# EasyEDA Pro project Crazybot.eprj

# Schematic Schematic1
Create Date: 2023-04-09; Page Name: P1; Project Name: Crazybot; Schematic Name: Schematic1; Update Date: 2023-04-14; Company: 嘉立创EDA; Page Size: A4; Version: V1.0
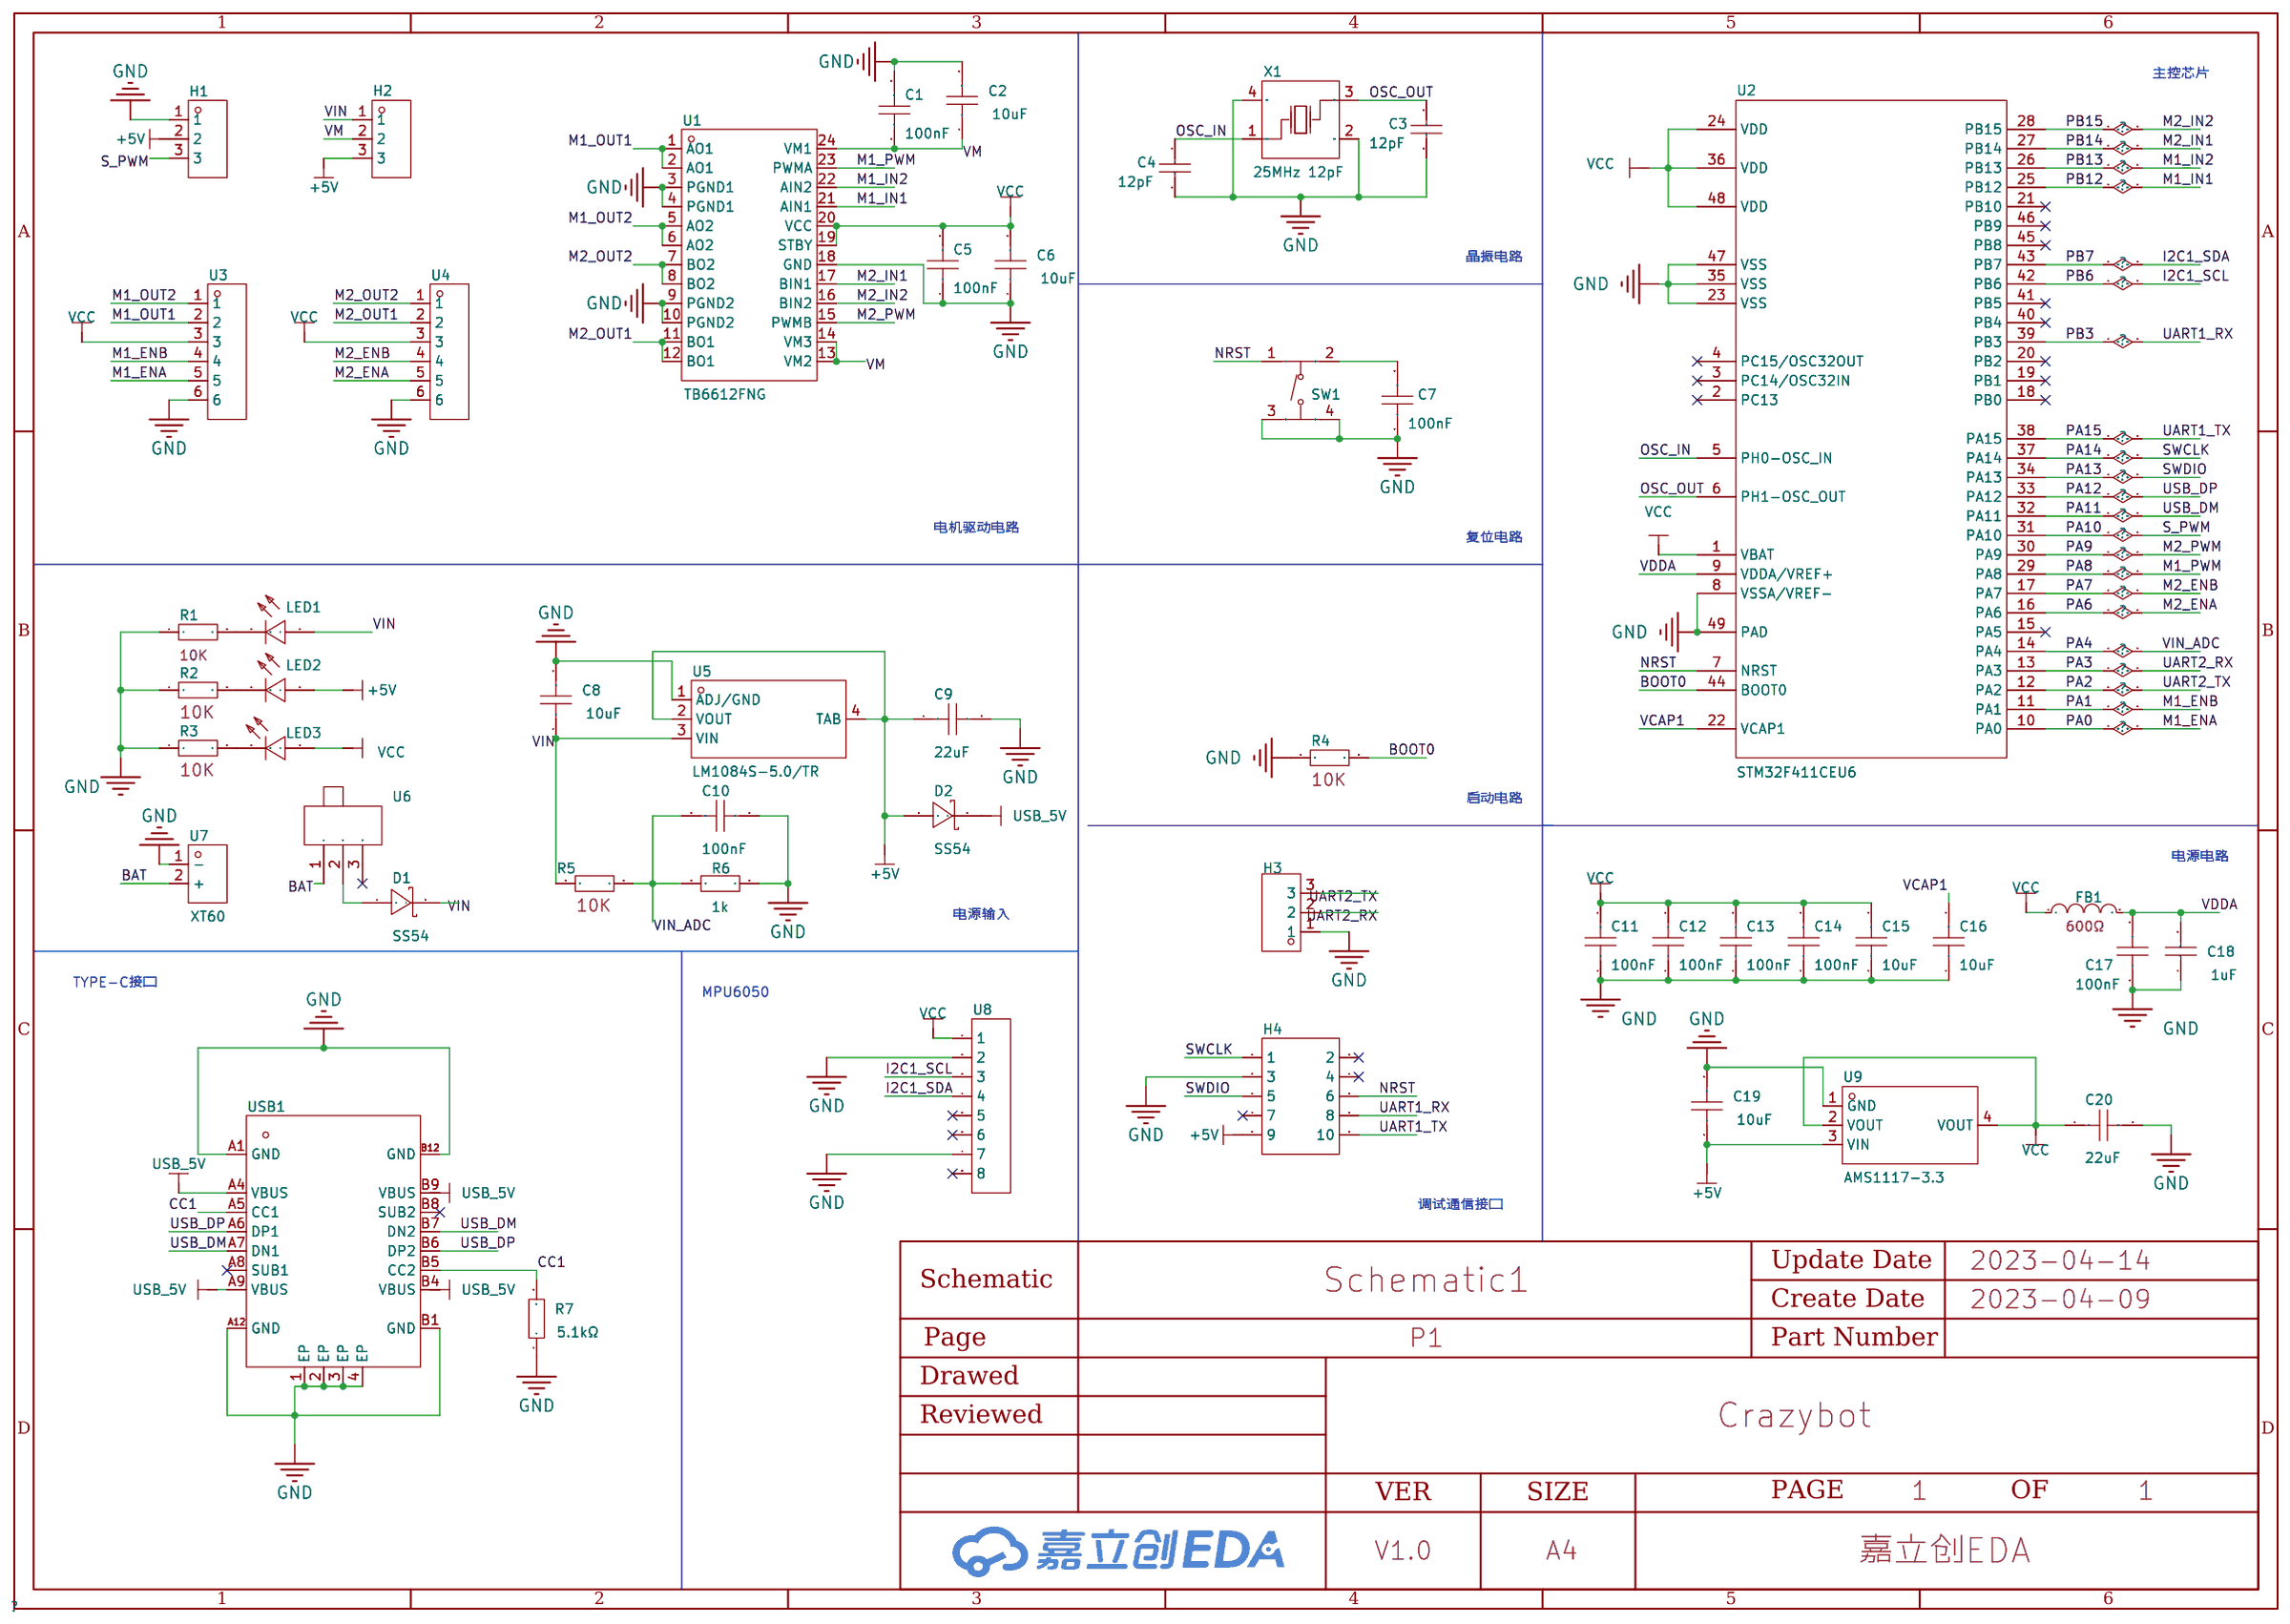
[diagram p0: schematic sheet]

## Parts
C1  100nF  [C0603]
C2  10uF  [C0603]
C3  12pF  [C0603]
C4  12pF  [C0603]
C5  100nF  [C0603]
C6  10uF  [C0603]
C7  100nF  [C0603]
C8  10uF  [C0603]
C9  22uF  [C0603]
C10  100nF  [C0603]
C11  100nF  [C0603]
C12  100nF  [C0603]
C13  100nF  [C0603]
C14  100nF  [C0603]
C15  10uF  [C0603]
C16  10uF  [C0603]
C17  100nF  [C0603]
C18  1uF  [C0603]
C19  10uF  [C0603]
C20  22uF  [C0603]
D1  SS54  [SMA_L4.4-W2.8-LS5.4-R-RD]
D2  SS54  [SMA_L4.4-W2.8-LS5.4-R-RD]
FB1  GZ1608D601TF  [L0603]
H1  -  [HDR-TH_3P-P2.54-V-M]
H2  -  [HDR-TH_3P-P2.54-V-M]
H3  -  [HDR-TH_3P-P2.54-V-F]
H4  -  [HDR-TH_10P-P2.54-V-F-R2-C5-S2.54]
LED1  19-213/Y2C-CQ2R2L/3T(CY)  [LED0603-RD-YELLOW]
LED2  19-217/GHC-YR1S2/3T  [LED0603-RD]
LED3  19-217/BHC-ZL1M2RY/3T  [LED0603-FD_BLUE]
R1  0603WAF1002T5E  [R0603]
R2  0603WAF1002T5E  [R0603]
R3  0603WAF1002T5E  [R0603]
R4  0603WAF1002T5E  [R0603]
R5  0603WAF1002T5E  [R0603]
R6  1k  [R0603]
R7  5.1kΩ  [R0603]
SW1  TS-1187A-B-A-B  [SW-SMD_4P-L5.1-W5.1-P3.70-LS6.5-TL-2]
U1  TB6612FNG  [SSOP-24_L8.4-W5.8-P0.65-LS7.8-BL]
U2  STM32F411CEU6  [UFQFPN-48_L7.0-W7.0-P0.50-BL-EP]
U3  HDGC2001WR-6P  [CONN-TH_6P-P2.00_HDGC_HDGC2001WR-6P]
U4  HDGC2001WR-6P  [CONN-TH_6P-P2.00_HDGC_HDGC2001WR-6P]
U5  LM1084S-5.0/TR  [TO-263-3_L8.6-W10.2-P2.54-LS14.4-TL]
U6  SS-12M12G5  [SW-TH_SS-12M12G5]
U7  XT60  [CONN-TH_XT60]
U8  -  [HDR-TH_8P-P2.54-V-F-1]
U9  AMS1117-3.3  [SOT-223-3_L6.5-W3.4-P2.30-LS7.0-BR]
USB1  KH-TYPE-C-16P  [USB-C-SMD_KH-TYPE-C-16P]
X1  25MHz 12pF  [OSC-SMD_4P-L3.2-W2.5-BL]

## Library data of the parts
C1 C5 C7 C10-C14 C17 = CC0603KRX7R9BB104: 容值:100nF;精度:±10%;额定电压:50V;材质(温度系数):X7R;; LCSC Part Name: 100nF ±10% 50V; Supplier Part: C14663; Manufacturer: YAGEO(国巨); Supplier Footprint: 0603; JLCPCB Part Class: 基础库; Datasheet: https://atta.szlcsc.com/upload/public/pdf/source/20180910/C282072_33301C7F631E79921B82A8DAC6BCC5B3.pdf; Supplier: LCSC; Tolerance: ±10%; Voltage Rated: 50V; Temperature Coefficient: X7R
C2 C6 C8 C15 C16 C19 = CL10A106MA8NRNC: 容值:10uF;精度:±20%;额定电压:25V;材质(温度系数):X5R;; LCSC Part Name: 10uF ±20% 25V; Supplier Part: C96446; Manufacturer: SAMSUNG(三星); Supplier Footprint: 0603; JLCPCB Part Class: 基础库; Datasheet: https://atta.szlcsc.com/upload/public/pdf/source/20170325/1490427913016.pdf; Supplier: LCSC; Tolerance: ±20%; Voltage Rated: 25V; Temperature Coefficient: X5R
C3 C4 = CL10C120JB8NNNC: 温度系数:C0G;容值:12pF;精度:±5%;额定电压:50V;; LCSC Part Name: 12pF ±5% 50V; Supplier Part: C38523; Manufacturer: SAMSUNG(三星); Supplier Footprint: 0603; JLCPCB Part Class: 基础库; Datasheet: https://atta.szlcsc.com/upload/public/pdf/source/20160103/1457707725436.pdf; Supplier: LCSC; Temperature Coefficient: C0G; Tolerance: ±5%; Voltage Rated: 50V
C9 C20 = CL10A226MQ8NRNC: 容值:22uF;精度:±20%;额定电压:6.3V;材质(温度系数):X5R;; LCSC Part Name: 22uF ±20% 6.3V; Supplier Part: C59461; Manufacturer: SAMSUNG(三星); Supplier Footprint: 0603; JLCPCB Part Class: 基础库; Datasheet: https://atta.szlcsc.com/upload/public/pdf/source/20160103/1457707740762.pdf; Supplier: LCSC; Tolerance: ±20%; Voltage Rated: 6.3V; Temperature Coefficient: X5R
C18 = CL10A105KB8NNNC: 容值:1uF;精度:±10%;额定电压:50V;材质(温度系数):X5R;; LCSC Part Name: 1uF ±10% 50V; Supplier Part: C15849; Manufacturer: SAMSUNG(三星); Supplier Footprint: 0603; JLCPCB Part Class: 基础库; Datasheet: https://atta.szlcsc.com/upload/public/pdf/source/20160103/1457707679084.pdf; Supplier: LCSC; Tolerance: ±10%; Voltage Rated: 50V; Temperature Coefficient: X5R
D1 D2 = SS54_C22452: 直流反向耐压(Vr):40V;平均整流电流(Io):5A;正向压降(Vf):550mV@5A;; LCSC Part Name: 40V 5A 550mV@5A; Supplier Part: C22452; Manufacturer: MDD; Supplier Footprint: SMA(DO-214AC); JLCPCB Part Class: 基础库; Datasheet: https://atta.szlcsc.com/upload/public/pdf/source/20230314/529CD85F9B31F69841D3A079BC07E377.pdf; Supplier: LCSC; Reverse Voltage (Vr): 40V; Average Rectified Current (Io): 5A; Forward Voltage (Vf@If): 550mV@5A
FB1 = GZ1608D601TF: 600Ω; LCSC Part Name: 600Ω@100MHz ±25%; Supplier Part: C1002; Manufacturer: Sunlord(顺络); Supplier Footprint: 0603; JLCPCB Part Class: 基础库; Datasheet: https://atta.szlcsc.com/upload/public/pdf/source/20210830/355EA7C0FAC5394FC0FE3F17C770C20A.pdf; Supplier: LCSC; Impedance @ Frequency: 600Ω@100MHz; Tolerance: ±25%; DC Resistance: 450mΩ; Current Rating: 200mA; Circuits: 1
H1 H2 = HDR-M_2.54_1x3P: Supplier Part: C2937625; Supplier Footprint: 插件
H3 = HDR-F_2.54_1x3P: Supplier Part: C541850; Supplier Footprint: 插件
H4 = HDR-F_2.54_2x5: Supplier Part: C92270; Supplier Footprint: 插件
LED1 = 19-213/Y2C-CQ2R2L/3T(CY): 发光颜色:黄灯;二极管配置:-;透镜颜色:无色透明;主波长:585.5nm~591.5nm;峰值波长:591nm;色温:-;测试电流:20mA;功率:60mW;发光角度:120°;安装方式:-;工作温度:-40℃~+85℃;; LCSC Part Name: 黄灯 585.5nm~591.5nm; Supplier Part: C72038; Manufacturer: EVERLIGHT(亿光); Supplier Footprint: 0603; JLCPCB Part Class: 基础库; Datasheet: https://atta.szlcsc.com/upload/public/pdf/source/20160507/1462613613586.pdf; Supplier: LCSC; Emitted Color: 黄灯; Lens Color: 无色透明; Dominant Wavelength: 585.5nm~591.5nm; Peak Wavelength: 591nm; Forward Current: 20mA; Power Dissipation: 60mW; Viewing Angle: 120°; Operating Temperature: -40℃~+85℃
LED2 = 19-217/GHC-YR1S2/3T: 发光颜色:翠绿;二极管配置:-;透镜颜色:无色透明;主波长:520nm~535nm;峰值波长:518nm;色温:-;测试电流:20mA;功率:110mW;发光角度:120°;安装方式:-;工作温度:-40℃~+85℃;; LCSC Part Name: 翠绿 520nm~535nm; Supplier Part: C72043; Manufacturer: EVERLIGHT(亿光); Supplier Footprint: 0603; JLCPCB Part Class: 基础库; Datasheet: https://atta.szlcsc.com/upload/public/pdf/source/20160507/1462613613780.pdf; Supplier: LCSC; Emitted Color: 翠绿; Lens Color: 无色透明; Dominant Wavelength: 520nm~535nm; Peak Wavelength: 518nm; Forward Current: 20mA; Power Dissipation: 110mW; Viewing Angle: 120°; Operating Temperature: -40℃~+85℃
LED3 = 19-217/BHC-ZL1M2RY/3T: 照明颜色:蓝色;主波长/色坐标:465~475nm;; LCSC Part Name: 0603 蓝灯; Supplier Part: C72041; Manufacturer: EVERLIGHT(亿光); Supplier Footprint: 0603; JLCPCB Part Class: 基础库; Datasheet: https://atta.szlcsc.com/upload/public/pdf/source/20170116/1484561237273.pdf; Supplier: LCSC; Mounting Type: 表面贴装; Illumination Color: 蓝色; Luminous Intensity (IF=20mA): 11.5~28.5mcd@5mA; Dominant Wavelength / Coordinate rank: 465~475nm
R1-R5 = 0603WAF1002T5E: LCSC Part Name: 10K; Supplier Part: C25804; Manufacturer: UNI-ROYAL(厚声); Supplier Footprint: 0603; JLCPCB Part Class: 基础库; Datasheet: https://atta.szlcsc.com/upload/public/pdf/source/20170920/C25804_1505901551523983377.pdf; Supplier: LCSC
R6 = 0603WAF1001T5E: 电阻类型:厚膜电阻;阻值:1kΩ;精度:±1%;功率:100mW;; LCSC Part Name: 1kΩ ±1% 100mW; Supplier Part: C21190; Manufacturer: UNI-ROYAL(厚声); Supplier Footprint: 0603; JLCPCB Part Class: 基础库; Datasheet: https://atta.szlcsc.com/upload/public/pdf/source/20200306/C422600_1E6D84923E4A46A82E41ADD87F860B5C.pdf; Supplier: LCSC; Type: 厚膜电阻; Tolerance: ±1%; Power(Watts): 100mW; Temperature Coefficient: ±100ppm/℃; Overload Voltage (Max): 75V; Operating Temperature Range: -55℃~+155℃
R7 = 0603WAF5101T5E: 电阻类型:厚膜电阻;阻值:5.1kΩ;精度:±1%;功率:100mW;; LCSC Part Name: 5.1kΩ ±1% 100mW; Supplier Part: C23186; Manufacturer: UNI-ROYAL(厚声); Supplier Footprint: 0603; JLCPCB Part Class: 基础库; Datasheet: https://atta.szlcsc.com/upload/public/pdf/source/20200306/C422600_1E6D84923E4A46A82E41ADD87F860B5C.pdf; Supplier: LCSC; Type: 厚膜电阻; Tolerance: ±1%; Power(Watts): 100mW; Temperature Coefficient: ±100ppm/℃; Overload Voltage (Max): 75V; Operating Temperature Range: -55℃~+155℃
SW1 = TS-1187A-B-A-B: 触点电流:50mA;额定电压(DC):12V;绝缘电阻:100mΩ;电路结构:单刀单掷;安装方式:立贴;按钮形状:圆形按钮;按钮/盖帽颜色:金色;带灯:无;作用力:160gf;机械寿命:100000;工作温度:-30℃~+85℃;开关长度:5.1mm;开关宽度:5.1mm;开关高度:1.5mm;带支架:无;; LCSC Part Name: 轻触开关 5.1*5.1*1.5贴片 防水金属头160gf; Supplier Part: C318884; Manufacturer: XKB Connectivity(中国星坤); Supplier Footprint: SMD; JLCPCB Part Class: 基础库; Datasheet: https://atta.szlcsc.com/upload/public/pdf/source/20200227/C318884_1F20165719E1C4CAA3E10C4C359C6E26.pdf; Supplier: LCSC; Contact Current: 50mA; Voltage Rating (DC): 12V; Insulation Resistance: 100mΩ; Circuit: 单刀单掷; Mounting Style: 立贴; Actuator Style: 圆形按钮; Actuator/Cap Color: 金色; With Lamp: 无; Operating Force: 160gf; Mechanical Life: 100000; Operating Temperature: -30℃~+85℃; Switch Length: 5.1mm; Switch Width: 5.1mm; Switch Height: 1.5mm; Strike Gundam: 无
U1 = TB6612FNG(O,C,8,EL: 双直流电机驱动器集成电路; Supplier Part: C88224; Manufacturer: TOSHIBA(东芝); Supplier Footprint: SSOP-24_208mil; JLCPCB Part Class: 扩展库; Datasheet: https://atta.szlcsc.com/upload/public/pdf/source/20170412/1491969113864.pdf; Supplier: LCSC
U2 = STM32F411CEU6: 工作电压:1.7V ~ 3.6V;主频（MAX):100MHz;; Supplier Part: C60420; Manufacturer: ST(意法半导体); Supplier Footprint: UFQFPN-48; JLCPCB Part Class: 扩展库; Datasheet: https://atta.szlcsc.com/upload/public/pdf/source/20151026/1457707507170.pdf; Supplier: LCSC; UART/USART: 3 USART; SPI: 5; USB Device: 1; PWM: 32; USB Host/OTG: 1; I2C（SMBUS/PMBUS）: 3; Voltage - Supply (Vcc/Vdd): 1.7V ~ 3.6V; A/D: 10x12bit; Program Memory Size: 512KB; RAM Size: 128KB; Speed: 100MHz; Number of I/O: 36
U3 U4 = HDGC2001WR-6P: LCSC Part Name: PH2.0弯针 6P; Supplier Part: C5175243; Manufacturer: HDGC(华德共创); Supplier Footprint: 弯插,P=2mm; JLCPCB Part Class: 扩展库; Datasheet: https://atta.szlcsc.com/upload/public/pdf/source/20220916/36534CA64A2134C65DEF28B604EC5CCB.pdf; Supplier: LCSC
U5 = LM1084S-5.0/TR: 最大输入电压:12V;压降(max):1.5V @ 5A;输出电压(可调):-;静态电流(Iq):-;输出类型:固定;输出电压(固定):5V;; Supplier Part: C259973; Manufacturer: HGSEMI(华冠); Supplier Footprint: TO-263-3L; JLCPCB Part Class: 扩展库; Datasheet: https://atta.szlcsc.com/upload/public/pdf/source/20181026/C259973_D4A8C77477BC653F2A46298C4B478943.pdf; Supplier: LCSC; Current - Supply (Max): 10mA; Voltage - Input (Max): 12V; Voltage Dropout (Max): 1.5V @ 5A; Output Current (Max): 5A; Output Configuration: 正; Ripple Rejection (PSRR): 72dB ~ 60dB(120Hz); Output Type: 固定; Number of Output Channels: 1; Operating Temperature: 0℃ ~ 125℃; Voltage - Output (Fixed): 5V
U6 = SS-12M12G5: 额定电流(DC):6A;额定电压(DC):120V;额定电流(AC):6A;额定电压(AC):120V;电路结构:单刀双掷;安装方式:弯插;机械寿命:10000;开关颜色:黑色;滑钮形状:矩形柱状;引脚样式:PC引脚;工作温度:-40℃~+85℃;开关长度:13.2mm;开关宽度:7.2mm;开关高度:6.6mm;; Supplier Part: C2884789; Manufacturer: XKB Connectivity(中国星坤); Supplier Footprint: 插件; JLCPCB Part Class: 扩展库; Datasheet: https://atta.szlcsc.com/upload/public/pdf/source/20211009/F44B934214AE410D67AA0A05A88FD376.pdf; Supplier: LCSC; Current Rating (DC): 6A; Voltage Rating (DC): 120V; Current Rating (AC): 6A; Voltage Rating (AC): 120V; Circuit: 单刀双掷; Mounting Style: 弯插; Mechanical Life: 10000; Actuator Color: 黑色; Actuator Style: 矩形柱状; Pin Style: PC引脚; Operating Temperature: -40℃~+85℃; Switch Length: 13.2mm; Switch Width: 7.2mm; Switch Height: 6.6mm
U7 = XT60: 模型锂电连接器 XT60-M; LCSC Part Name: XT60公头（电调端）; Supplier Part: C98733; Manufacturer: AMASS(艾迈斯); JLCPCB Part Class: 扩展库; Datasheet: https://atta.szlcsc.com/upload/public/pdf/source/20170606/1496716524919.pdf; Supplier: LCSC
U8 = HDR-F_2.54_1x8P: Supplier Part: C27438; Supplier Footprint: 插件
U9 = AMS1117-3.3_C6186: 输出类型:固定;输出极性:正;最大输入电压:-;输出电压:3.3V;输出电流:1A;电源纹波抑制比(PSRR):72dB@(120Hz);; LCSC Part Name: 正 Vout=3.3V 1A 72dB@(120Hz); Supplier Part: C6186; Manufacturer: AMS; Supplier Footprint: SOT-223; JLCPCB Part Class: 基础库; Datasheet: https://atta.szlcsc.com/upload/public/pdf/source/20180727/C6186_7A095716F0823C02F1997A905E26C086.pdf; Supplier: LCSC; Output Type: 固定; Output Polarity: 正; Number of Outputs: 1; Output Voltage: 3.3V; Dropout Voltage: 1.3V@(800mA); Output Current: 1A; Power Supply Rejection Ratio (PSRR): 72dB@(120Hz)
USB1 = KH-TYPE-C-16P: Type-C母座 16PIN 立式四角贴板无压片; LCSC Part Name: Type-C母座; Supplier Part: C709357; Manufacturer: kinghelm(金航标); JLCPCB Part Class: 扩展库; Datasheet: https://atta.szlcsc.com/upload/public/pdf/source/20200911/C709357_AA8DCEB38BB20E3035A7ED7AE7667837.pdf; Supplier: LCSC
X1 = X322525MOB4SI: 频率:25MHz;频率公差:±10ppm;频率稳定度:±30ppm;负载电容:12pF;; LCSC Part Name: 25MHz ±10ppm 12pF; Supplier Part: C9006; Manufacturer: YXC(扬兴晶振); Supplier Footprint: SMD3225-4P; JLCPCB Part Class: 基础库; Datasheet: https://atta.szlcsc.com/upload/public/pdf/source/20210329/C112971_1F611BDC486E193C1706F6D8EB5AA189.pdf; Supplier: LCSC; Crystal Type: 贴片无源晶振; Frequency Tolerance: ±10ppm; Frequency Stability: ±30ppm; Load Capacitance: 12pF; Operating Temperature: -40℃~+85℃

## Nets
+5V: C9.1 C19.1 D2.1(A) H1.2 H2.3 H4.9 LED2.2(A) U5.2(VOUT) U5.4(TAB) U9.3(VIN)
GND: C1.2 C2.2 C3.1 C4.1 C5.1 C6.1 C7.1 C8.2 C9.2 C10.1 C11.1 C12.1 C13.1 C14.1 C15.1 C16.1 C17.1 C18.1 C19.2 C20.2 H1.1 H3.1 H4.3 R1.1 R2.1 R3.1 R4.1 R6.2 R7.1 SW1.3(C) SW1.4(D) U1.3(PGND1) U1.4(PGND1) U1.9(PGND2) U1.10(PGND2) U1.18(GND) U2.8(VSSA/VREF-) U2.23(VSS) U2.35(VSS) U2.47(VSS) U2.49(PAD) U3.6 U4.6 U5.1(ADJ/GND) U7.1(-) U8.2 U8.7 U9.1(GND) USB1.1(EP) USB1.2(EP) USB1.3(EP) USB1.4(EP) USB1.A1(GND) USB1.A12(GND) USB1.B1(GND) USB1.B12(GND) X1.2(GND) X1.4(GND)
VCC: C5.2 C6.2 C11.2 C12.2 C13.2 C14.2 C15.2 C20.1 FB1.1 LED3.2(A) U1.19(STBY) U1.20(VCC) U2.1(VBAT) U2.24(VDD) U2.36(VDD) U2.48(VDD) U3.3 U4.3 U8.1 U9.2(VOUT) U9.4(VOUT)
VDDA: C17.2 C18.2 FB1.2 U2.9(VDDA/VREF+)
VIN: C8.1 D1.2(K) H2.1 LED1.2(A) R5.2 U5.3(VIN)
BAT: U6.1 U7.2(+)
BOOT0: R4.2 U2.44(BOOT0)
CC1: R7.2 USB1.A5(CC1) USB1.B5(CC2)
I2C1_SCL: U2.42(PB6) U8.3
I2C1_SDA: U2.43(PB7) U8.4
M1_ENA: U2.10(PA0) U3.5
M1_ENB: U2.11(PA1) U3.4
M1_IN1: U1.21(AIN1) U2.25(PB12)
M1_IN2: U1.22(AIN2) U2.26(PB13)
M1_OUT1: U1.1(AO1) U1.2(AO1) U3.2
M1_OUT2: U1.5(AO2) U1.6(AO2) U3.1
M1_PWM: U1.23(PWMA) U2.29(PA8)
M2_ENA: U2.16(PA6) U4.5
M2_ENB: U2.17(PA7) U4.4
M2_IN1: U1.17(BIN1) U2.27(PB14)
M2_IN2: U1.16(BIN2) U2.28(PB15)
M2_OUT1: U1.11(BO1) U1.12(BO1) U4.2
M2_OUT2: U1.7(BO2) U1.8(BO2) U4.1
M2_PWM: U1.15(PWMB) U2.30(PA9)
NRST: H4.6 SW1.1(A) U2.7(NRST)
OSC_IN: C4.2 U2.5(PH0-OSC_IN) X1.1(OSC1)
OSC_OUT: C3.2 U2.6(PH1-OSC_OUT) X1.3(OSC2)
PA2: H3.3 U2.12(PA2)
PA3: H3.2 U2.13(PA3)
PA4: C10.2 R5.1 R6.1 U2.14(PA4)
PA10: H1.3 U2.31(PA10)
PA11: U2.32(PA11) USB1.A7(DN1) USB1.B7(DN2)
PA12: U2.33(PA12) USB1.A6(DP1) USB1.B6(DP2)
PA13: H4.5 U2.34(PA13)
PA14: H4.1 U2.37(PA14)
PA15: H4.10 U2.38(PA15)
PB3: H4.8 U2.39(PB3)
USB_5V: D2.2(K) USB1.A4(VBUS) USB1.A9(VBUS) USB1.B4(VBUS) USB1.B9(VBUS)
VCAP1: C16.2 U2.22(VCAP1)
VM: C1.1 C2.1 H2.2 U1.13(VM2) U1.14(VM3) U1.24(VM1)
$1N8094: C7.2 SW1.2(B)
$1N67980: D1.1(A) U6.2
Net-(LED1-1): LED1.1(C) R1.2
Net-(LED2-1): LED2.1(C) R2.2
Net-(LED3-1): LED3.1(C) R3.2

Not connected (* = marked no-connect by the designer): H4 2* 4* 7*; U2 2(PC13)* 3(PC14/OSC32IN)* 4(PC15/OSC32OUT)* 15(PA5)* 18(PB0)* 19(PB1)* 20(PB2)* 21(PB10)* 40(PB4)* 41(PB5)* 45(PB8)* 46(PB9)*; U6 3*; U8 5* 6* 8*; USB1 A8(SUB1)* B8(SUB2)*

## Notes on the sheet
- 主控芯片
- 晶振电路
- 电机驱动电路
- 复位电路
- 启动电路
- 电源电路
- 电源输入
- TYPE-C接口
- MPU6050
- 调试通信接口

# Board PCB1
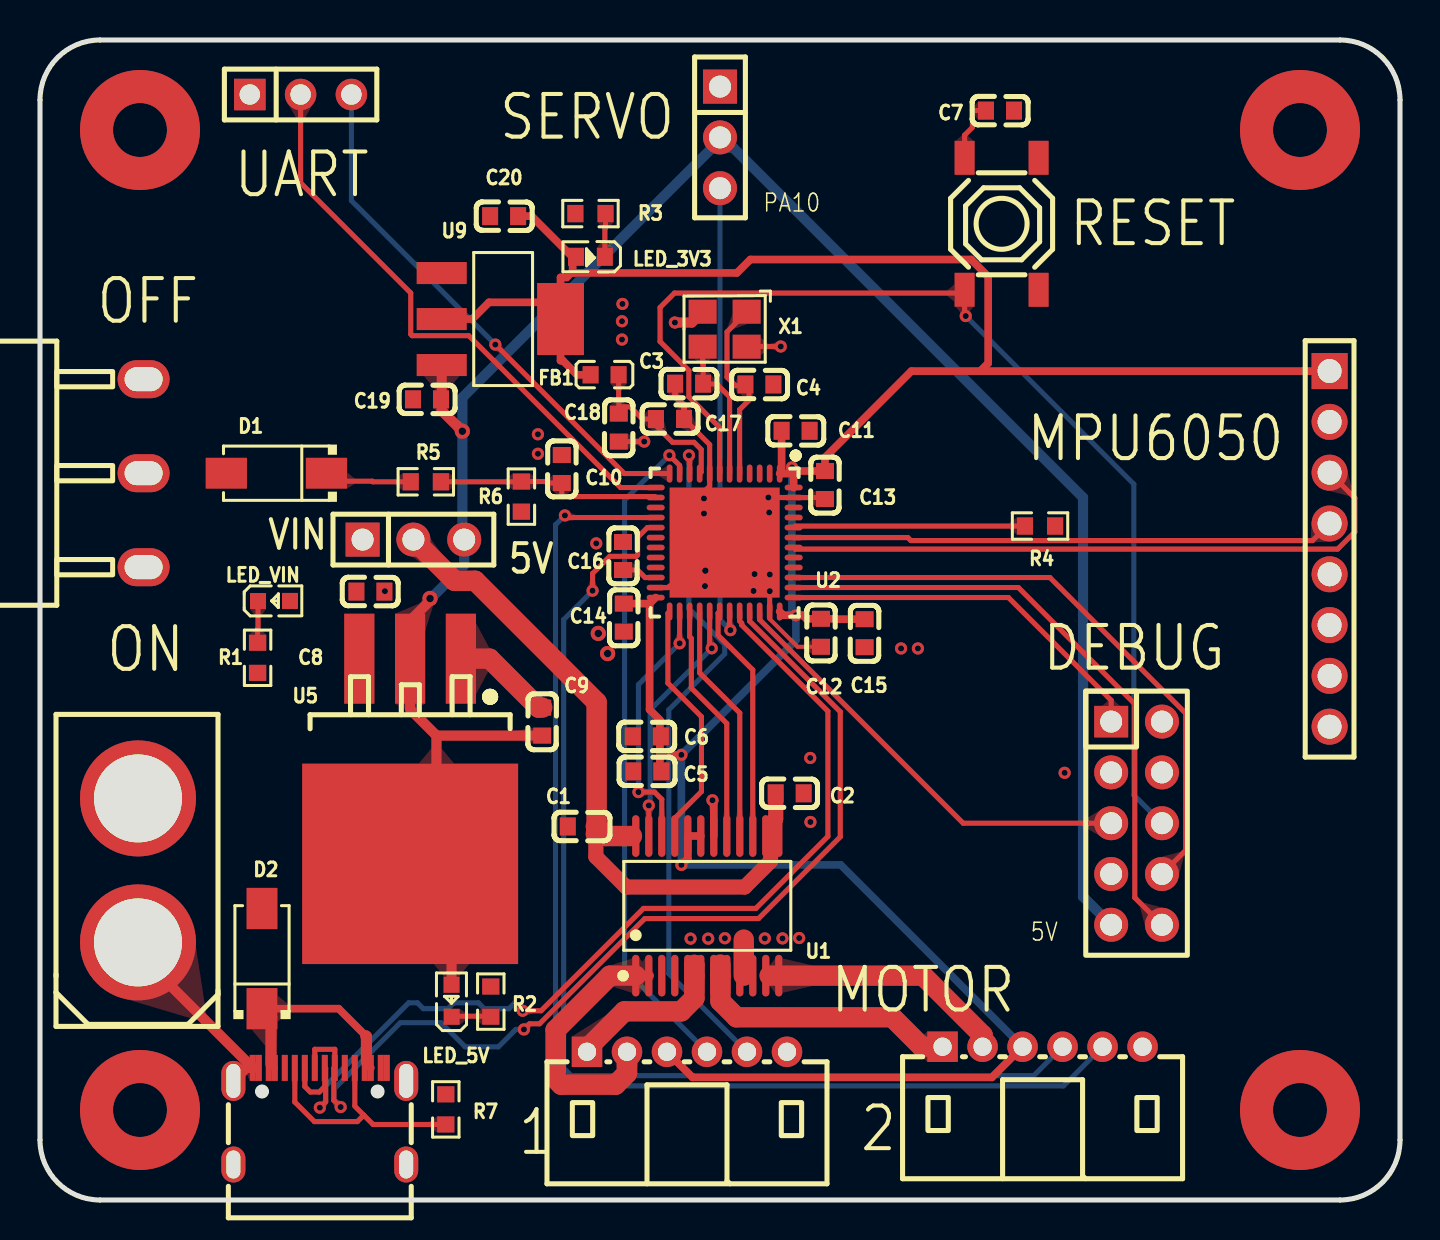
[diagram p1: board, top side]
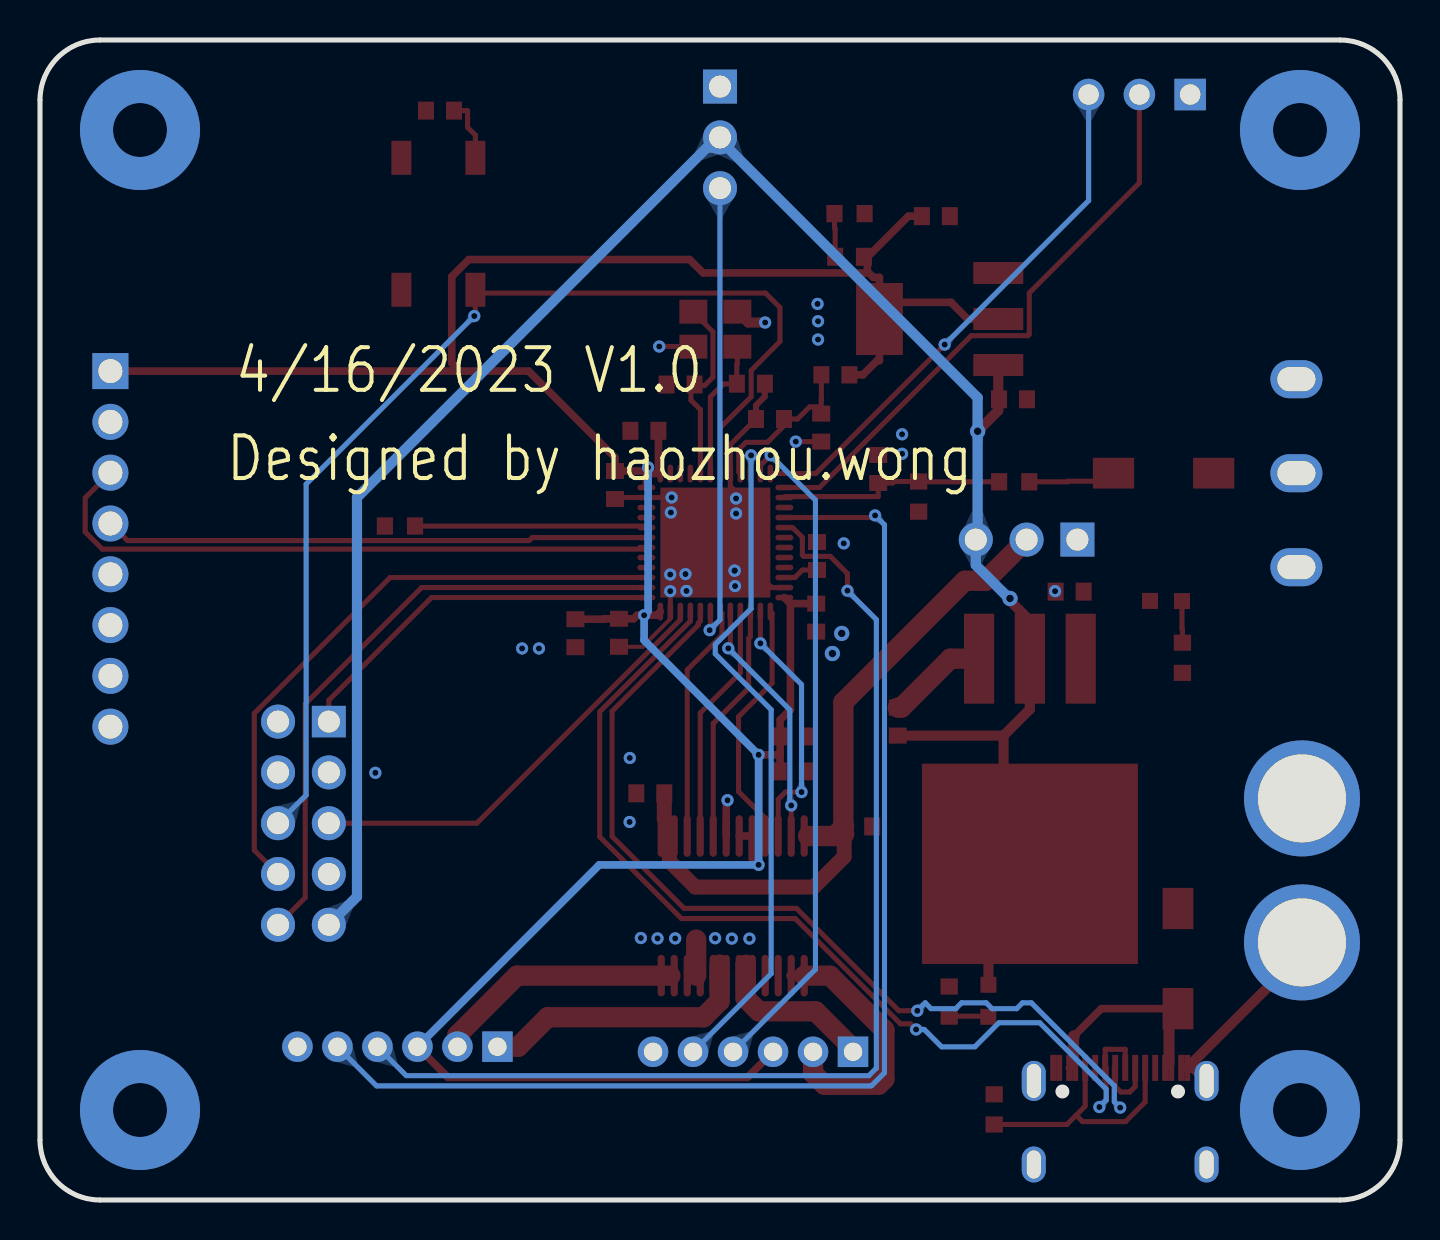
[diagram p2: board, bottom side, seen from below]

Outline 68 x 58 mm; copper layers: Top Layer, Bottom Layer. Coordinates in mm from the lower left corner of the outline.
Outline path: 0,55 0,3 arc(0.88,0.88) 3,0 65,0 arc(67.12,0.88) 68,3 68,55 arc(67.12,57.12) 65,58 3,58 arc(0.88,57.12) 0,55
Stack: Top Layer 0.035mm / Dielectric1 1.51mm FR4 er 4.5 / Bottom Layer 0.035mm

## Design rules (mm)
net PA11: DP1
net PA12: DP1
spacing safeClearance (default): track to track 0.152, other pairs 0.152 to 0.3
track width trackWidth (default): min 0.127, default 0.254, max 2.54
differential pair differentialPair (default): width min 0.127, default 0.254, max 2.54; gap min 0.152, default 0.152
via viaSize (default): diameter min 0.5, default 0.61, max 10; hole min 0.3, default 0.305, max 6

## Placement (name value [footprint] x y rotation side)
C1  100nF  [C0603]  27.09 18.68 180 top
C2  10uF  [C0603]  37.49 20.33 0 top
C3  12pF  [C0603]  32.46 40.82 0 top
C4  12pF  [C0603]  35.97 40.78 180 top
C5  100nF  [C0603]  30.36 21.43 0 top
C6  10uF  [C0603]  30.34 23.18 0 top
C7  100nF  [C0603]  48 54.47 180 top
C8  10uF  [C0603]  16.52 30.42 0 top
C9  22uF  [C0603]  25.11 23.92 90 top
C10  100nF  [C0603]  26.09 36.55 270 top
C11  100nF  [C0603]  37.78 38.46 180 top
C12  100nF  [C0603]  39.05 28.36 90 top
C13  100nF  [C0603]  39.25 35.75 90 top
C14  100nF  [C0603]  29.19 29.12 90 top
C15  10uF  [C0603]  41.23 28.34 90 top
C16  10uF  [C0603]  29.15 32.2 270 top
C17  100nF  [C0603]  31.5 39.05 180 top
C18  1uF  [C0603]  28.94 38.62 90 top
C19  10uF  [C0603]  19.35 40.03 180 top
C20  22uF  [C0603]  23.21 49.19 180 top
D1  SS54  [SMA_L4.4-W2.8-LS5.4-R-RD]  11.82 36.34 180 top
D2  SS54  [SMA_L4.4-W2.8-LS5.4-R-RD]  11.1 12.07 90 top
FB1  GZ1608D601TF  [L0603]  28.23 41.26 0 top
H1  -  [HDR-TH_3P-P2.54-V-M]  34 53.13 270 top
H2  -  [HDR-TH_3P-P2.54-V-M]  18.67 33.02 0 top
H3  -  [HDR-TH_3P-P2.54-V-F]  13.03 55.27 0 top
H4  -  [HDR-TH_10P-P2.54-V-F-R2-C5-S2.54]  54.83 18.84 270 top
LED_3V3  19-217/BHC-ZL1M2RY/3T  [LED0603-FD_BLUE]  27.52 47.16 180 top
LED_5V  19-217/GHC-YR1S2/3T  [LED0603-RD]  20.58 9.96 90 top
LED_VIN  19-213/Y2C-CQ2R2L/3T(CY)  [LED0603-RD-YELLOW]  11.7 29.95 0 top
R1  0603WAF1002T5E  [R0603]  10.88 27.11 90 top
R2  0603WAF1002T5E  [R0603]  22.54 9.92 270 top
R3  0603WAF1002T5E  [R0603]  27.52 49.32 0 top
R4  0603WAF1002T5E  [R0603]  50 33.7 180 top
R5  0603WAF1002T5E  [R0603]  19.29 35.91 180 top
R6  1k  [R0603]  24.07 35.17 270 top
R7  5.1kΩ  [R0603]  20.29 4.53 270 top
SW1  TS-1187A-B-A-B  [SW-SMD_4P-L5.1-W5.1-P3.70-LS6.5-TL-2]  48.08 48.81 90 top
U1  TB6612FNG  [SSOP-24_L8.4-W5.8-P0.65-LS7.8-BL]  33.36 14.71 0 top
U2  STM32F411CEU6  [UFQFPN-48_L7.0-W7.0-P0.50-BL-EP]  34.23 32.87 180 top
U3  HDGC2001WR-6P  [CONN-TH_6P-P2.00_HDGC_HDGC2001WR-6P]  32.35 7.41 0 top
U4  HDGC2001WR-6P  [CONN-TH_6P-P2.00_HDGC_HDGC2001WR-6P]  50.13 7.66 0 top
U5  LM1084S-5.0/TR  [TO-263-3_L8.6-W10.2-P2.54-LS14.4-TL]  18.51 21.94 270 top
U6  SS-12M12G5  [SW-TH_SS-12M12G5]  5.18 36.34 90 top
U7  XT60  [CONN-TH_XT60]  4.9 16.48 90 top
U8  -  [HDR-TH_8P-P2.54-V-F-1]  64.48 32.56 270 top
U9  AMS1117-3.3  [SOT-223-3_L6.5-W3.4-P2.30-LS7.0-BR]  23.06 44.05 180 top
USB1  KH-TYPE-C-16P  [USB-C-SMD_KH-TYPE-C-16P]  13.99 4.19 0 top
X1  25MHz 12pF  [OSC-SMD_4P-L3.2-W2.5-BL]  34.23 43.54 180 top

## Footprints (pads in the part's own frame, mm; a bottom-side part is the same pattern mirrored in y, then rotated)
C0603
  rect 0.8x0.9 smd: 1(-0.7,0) 2(0.7,0)
CONN-TH_6P-P2.00_HDGC_HDGC2001WR-6P
  rect 1.524x1.524 hole 0.914: 1(-5,0)
  round 1.524 hole 0.914: 2(-3,0) 3(-1,0) 4(1,0) 5(3,0) 6(5,0)
CONN-TH_XT60
  round 5.8 hole 4.4: 1(-3.6,0) 2(3.6,0)
HDR-TH_3P-P2.54-V-F
  rect 1.575x1.575 hole 1.02: 1(-2.54,0)
  round 1.575 hole 1.02: 2(0,0) 3(2.54,0)
HDR-TH_3P-P2.54-V-M
  rect 1.7x1.7 hole 1.1: 1(-2.54,0)
  round 1.7 hole 1.1: 2(0,0) 3(2.54,0)
HDR-TH_8P-P2.54-V-F-1
  rect 1.801x1.801 hole 1.199: 1(-8.89,0)
  round 1.801 hole 1.199: 2(-6.35,0) 3(-3.81,0) 4(-1.27,0) 5(1.27,0) 6(3.81,0) 7(6.35,0) 8(8.89,0)
HDR-TH_10P-P2.54-V-F-R2-C5-S2.54
  rect 1.575x1.7 hole 1.1: 1(-5.08,-1.27)
  round 1.7 hole 1.1: 2(-5.08,1.27) 3(-2.54,-1.27) 4(-2.54,1.27) 5(0,-1.27) 6(0,1.27) 7(2.54,-1.27) 8(2.54,1.27) 9(5.08,-1.27) 10(5.08,1.27)
L0603
  rect 0.8x0.864 smd: 1(-0.7,0) 2(0.7,0)
LED0603-FD_BLUE
  rect 0.8x0.9 smd: 1(-0.72,0) 2(0.72,0)
LED0603-RD
  rect 0.8x0.8 smd: 1(-0.799,-0.004) 2(0.799,0.004)
LED0603-RD-YELLOW
  rect 0.8x0.8 smd: 1(-0.799,-0.004) 2(0.799,0.004)
OSC-SMD_4P-L3.2-W2.5-BL
  rect 1.4x1.2 smd: 1(-1.1,-0.875) 2(1.1,-0.875) 3(1.1,0.875) 4(-1.1,0.875)
R0603
  rect 0.806x0.864 smd: 1(-0.753,0) 2(0.753,0)
SMA_L4.4-W2.8-LS5.4-R-RD
  rect 2.062x1.539 smd: 1(2.503,0) 2(-2.503,0)
SOT-223-3_L6.5-W3.4-P2.30-LS7.0-BR
  rect 2.5x1.1 smd: 1(2.97,-2.3) 2(2.97,0) 3(2.97,2.3)
  rect 2.34x3.6 smd: 4(-2.97,0)
SSOP-24_L8.4-W5.8-P0.65-LS7.8-BL
  oval 0.364x2.082 smd: 1(-3.575,-3.491) 2(-2.925,-3.491) 3(-2.275,-3.491) 4(-1.625,-3.491) 5(-0.975,-3.491) 6(-0.325,-3.491) 7(0.325,-3.491) 8(0.975,-3.491) 9(1.625,-3.491) 10(2.275,-3.491) 11(2.925,-3.491) 12(3.575,-3.491) 13(3.575,3.491) 14(2.925,3.491) 15(2.275,3.491) 16(1.625,3.491) 17(0.975,3.491) 18(0.325,3.491) 19(-0.325,3.491) 20(-0.975,3.491) 21(-1.625,3.491) 22(-2.275,3.491) 23(-2.925,3.491) 24(-3.575,3.491)
SW-SMD_4P-L5.1-W5.1-P3.70-LS6.5-TL-2
  rect 1.7x1 smd: 1(-3.3,1.85) 2(3.3,1.85) 3(-3.3,-1.85) 4(3.3,-1.85)
SW-TH_SS-12M12G5
  oval 1.9x2.6 hole 1.2x1.9: 1(-4.7,0) 2(0,0) 3(4.7,0)
TO-263-3_L8.6-W10.2-P2.54-LS14.4-TL
  rect 4.5x1.511 smd: 1(-5.128,2.54) 2(-5.128,0) 3(-5.128,-2.54)
  rect 10.02x10.8 smd: 4(5.129,0)
UFQFPN-48_L7.0-W7.0-P0.50-BL-EP
  oval 0.28x0.9 smd: 1(-2.751,-3.45) 2(-2.251,-3.45) 3(-1.75,-3.45) 4(-1.25,-3.45) 5(-0.749,-3.45) 6(-0.249,-3.45) 7(0.249,-3.45) 8(0.75,-3.45) 9(1.25,-3.45) 10(1.75,-3.45) 11(2.251,-3.45) 12(2.751,-3.45) 25(2.751,3.449) 26(2.251,3.449) 27(1.75,3.449) 28(1.25,3.449) 29(0.75,3.449) 30(0.249,3.449) 31(-0.249,3.449) 32(-0.749,3.449) 33(-1.25,3.449) 34(-1.75,3.449) 35(-2.251,3.449) 36(-2.751,3.449)
  oval 0.9x0.28 smd: 13(3.45,-2.751) 14(3.45,-2.251) 15(3.45,-1.75) 16(3.45,-1.25) 17(3.45,-0.75) 18(3.45,-0.249) 19(3.45,0.249) 20(3.45,0.749) 21(3.45,1.25) 22(3.45,1.75) 23(3.45,2.251) 24(3.45,2.751) 37(-3.449,2.751) 38(-3.449,2.251) 39(-3.449,1.75) 40(-3.449,1.25) 41(-3.449,0.749) 42(-3.449,0.249) 43(-3.449,-0.249) 44(-3.449,-0.75) 45(-3.449,-1.25) 46(-3.449,-1.75) 47(-3.449,-2.251) 48(-3.449,-2.751)
  rect 5.5x5.5 smd: 49(0,0)
USB-C-SMD_KH-TYPE-C-16P
  oval 1.2x2 hole 0.7x1.7: 1(-4.32,1.765) 2(4.32,1.765)
  oval 1.2x1.8 hole 0.7x1.4: 3(-4.32,-2.415) 4(4.32,-2.415)
  rect 0.3x1.3 smd: A1(-3.35,2.415) A4(-2.55,2.415) A5(-1.25,2.415) A6(-0.25,2.415) A7(0.25,2.415) A8(1.25,2.415) A9(2.55,2.415) A12(3.35,2.415) B1(3.05,2.415) B4(2.25,2.415) B5(1.75,2.415) B6(0.75,2.415) B7(-0.75,2.415) B8(-1.75,2.415) B9(-2.25,2.415) B12(-3.05,2.415)

## Nets
As in the schematic, except:
+5V: C9.1 C19.1 D2.1 H1.2 H2.3 H4.9 LED_5V.2 U5.2 U5.4 U9.3
VCC: C5.2 C6.2 C11.2 C12.2 C13.2 C14.2 C15.2 C20.1 FB1.1 LED_3V3.2 U1.19 U1.20 U2.1 U2.24 U2.36 U2.48 U3.3 U4.3 U8.1 U9.2 U9.4
VIN: C8.1 D1.2 H2.1 LED_VIN.2 R5.2 U5.3
$1N38986: LED_5V.1 R2.2
$1N39065: LED_3V3.1 R3.2
$1N77283: LED_VIN.1 R1.2

Pads without a net: H4 2 4 7; U2 2 3 4 15 18 19 20 21 40 41 45 46; U6 3; U8 5 6 8; USB1 A8 B8

## Via types
v1: diameter 0.61, hole 0.305, Top Layer to Bottom Layer, 53 vias
v2: diameter 6, hole 2.7, Top Layer to Bottom Layer, 4 vias
v3: diameter 0.762, hole 0.381, Top Layer to Bottom Layer, 4 vias

## Routing (per net, layer and track width the routed paths; a pad name or vN(x,y) marks a point on that pad's centre or on a via; arc(x,y) is an arc through that point)
+5V: length 108
  Top Layer w0.508: 19.82,23.22 19.82,18.32 18.31,16.81 ; 19.82,23.22 C9.1 ; 19.82,23.22 18.51,24.54 U5.2 18.51,28.97 19.5,29.97 v3(19.5,30.08) ; U5.4 20.58,14.74 LED_5V.2 ; v3(21.12,38.44) 20.09,39.47 U9.3
  Bottom Layer w0.508: v3(19.5,30.08) 19.54,30.08 21.21,31.74 H2.3 ; 34,53.13 34,52.74 ; 34,52.74 H1.2 ; 34,52.74 34.13,52.62 ; 34.17,52.66 34.13,52.62 ; 34.13,52.62 34.66,52.62 52.15,35.12 52.15,15.17 H4.9 ; 34.13,52.62 33.62,52.62 21.12,40.12 v3(21.12,38.44) 21.12,33.11 21.21,33.02
GND: length 39.6
  Top Layer w0.203: C12.1 37.88,27.66 36.48,29.05 36.48,29.42
  Top Layer w0.254: C18.1 v1(30.21,37.92) ; 35.33,42.69 35.35,42.68 v1(37.04,42.68) ; v1(33.25,30.7) 31.49,30.7 31.41,30.62 U2.23 ; C13.1 39.18,35.12 U2.47 37.05,35.12 37.05,35.13 v1(36.42,35.13) ; 36.48,29.42 36.48,30.44 v1(36.49,30.44) ; C17.1 33.48,37.77 33.48,35.69 33.2,35.41 v1(33.2,35.08)
  Top Layer w0.305: C17.1 32.2,39.73 31.76,40.17 31.76,40.8
  Top Layer w0.381: v1(33.62,19.99) 33.69,19.92 U1.18
  Top Layer w0.508: v1(31.74,43.87) 32.59,43.87 X1.2 ; U7.1 4.9,12.34 USB1.A1 10.32,6.6 9.67,5.96
  Top Layer w1.016: 35.19,11.22 35.19,13.02 ; C9.2 24.93,24.62 22.48,27.07 U5.1
  vias: v1(17.25,30.44) v1(24.9,38.29) v1(24.9,37.31) v1(27.81,32.83) v1(27.91,28.33) v1(29.12,44.8) v1(29.1,43.94) v1(29.1,43.02) v1(32.53,13.07) v1(33.2,34.32) v1(33.27,31.47) v1(33.27,31.47) v1(33.41,13.07) v1(34.24,13.09) v1(35.73,31.3) v1(35.68,30.45) v1(36.24,13.08) v1(36.46,34.37) v1(36.49,31.28) v1(37.12,13.08) v1(37.96,13.1) v1(38.51,22.1) v1(38.52,18.9) v1(43.05,27.58) v1(43.9,27.58) v1(51.23,21.36) v2(5,53.5) v2(5,4.5) v2(63,53.5) v2(63,4.5) v3(27.91,28.33) v3(28.38,27.32)
VCC: length 157.3
  Top Layer w0.381: 47.01,41.44 47.41,41.84 47.41,46.17 46.56,47.02 35.52,47.02 34.84,46.35 26.71,46.35 26.63,46.43 ; 47.01,41.44 43.57,41.44 39.25,37.13 39.25,36.45 37.78,36.45 37.68,36.55 ; 47.01,41.44 64.48,41.44 ; 26.63,46.43 26.33,46.13 26.03,46.13 26.03,44.88 ; 26.63,46.43 26.63,47.16 ; C20.1 24.58,49.19 26.61,47.16 26.63,47.16 ; C15.2 39.8,29.04 39.78,29.06 C12.2 38.32,29.06 38.14,29.24 v1(37.79,29.24) 37.17,29.24 U2.36 ; 31.35,7.41 32.63,6.13 47.6,6.13 U4.3 ; 37.08,36.32 U2.1 ; 37.08,36.32 C11.2 ; 37.08,36.32 37.68,36.32 ; 37.68,36.32 37.68,35.62 ; 37.68,36.32 37.68,36.55 ; 30.48,29.82 30.78,30.12 ; 30.48,29.82 30.48,24.52 30.99,24 30.99,22.26 ; 30.48,29.82 C14.2 ; 26.03,44.88 26.03,41.97 26.14,41.97 26.85,41.26 27.53,41.26 ; 26.03,44.88 22.45,44.88 21.62,44.05 U9.2 ; U1.19 32.39,18.2 32.39,17.08 v1(32.07,16.76) ; 30.99,22.26 v1(32.07,22.26) ; 30.99,22.26 30.99,21.24 ; 37.68,36.55 v1(37.6,36.63) ; 26.8,47.16 26.63,47.16
  Bottom Layer w0.381: v1(37.6,36.63) 37.6,29.44 v1(37.79,29.24) 37.79,27.99 v1(32.07,22.26) v1(32.07,16.76) 40.04,16.76 U4.3
VDDA: length 8.5
  Top Layer w0.254: U2.9 33.06,36.4 33.06,37.53 32.7,37.88 31.63,37.88 30.46,39.05 ; 28.94,39.66 29.51,39.66 30.12,39.05 30.46,39.05 ; 28.94,39.66 C18.2 ; 28.94,39.66 28.94,40 28.93,40.01 FB1.2 ; C17.2 30.46,39.05
VIN: length 4.4
  Top Layer w0.254: D1.2 14.72,35.94 16.61,35.94 16.64,35.91 R5.2
BOOT0: length 11.6
  Top Layer w0.254: 49.25,33.7 37.76,33.7 37.68,33.62
CC1: length 12.5
  Top Layer w0.254: USB1.A5 12.74,4.9 13.72,3.92 15.87,3.92 16.19,4.24 ; R7.2 16.65,3.78 16.19,4.24 ; 15.74,4.69 16.19,4.24 ; USB1.B5 15.74,4.72
I2C1_SCL: length 31.9
  Top Layer w0.254: 64.48,36.36 65.74,35.11 65.74,33.4 64.88,32.55 37.76,32.55 37.68,32.62
I2C1_SDA: length 27.2
  Top Layer w0.254: 64.48,33.83 63.63,32.97 43.54,32.97 43.39,33.12 37.68,33.12
M1_ENA: length 34.3
  Top Layer w0.254: v1(32.45,37.23) 32.48,37.2 U2.10
  Bottom Layer w0.254: 35.35,7.41 31.44,11.32 31.44,24.51 34.23,27.31 34.23,27.78 32.45,29.57 v1(32.45,37.23)
M1_ENB: length 33.6
  Top Layer w0.254: v1(31.47,37.24) 31.98,36.73 31.98,36.32
  Bottom Layer w0.254: 33.35,7.41 29.23,11.53 29.23,35 v1(31.47,37.24)
M1_IN1: length 12.5
  Top Layer w0.254: 31.48,29.42 31.39,29.34 31.39,25.84 33.07,24.17 33.07,20.42 31.74,19.09 U1.21
M1_IN2: length 13
  Top Layer w0.254: v1(31.98,27.83) 31.98,29.42 ; 31.09,18.2 31.09,20.03 30.73,20.4 v1(29.92,20.4)
  Bottom Layer w0.254: v1(29.92,20.4) 29.92,25.77 v1(31.98,27.83)
M1_OUT1: length 13.2
  Top Layer w0.508: U1.2 29.79,11.22
  Top Layer w1.016: 29.79,11.22 28.5,11.22 25.78,8.5 25.78,6.05 26.06,5.76 28.78,5.76 29.35,6.34 29.35,7.41
M1_OUT2: length 8.9
  Top Layer w0.381: 32.39,11.22 U1.6
  Top Layer w1.016: 27.35,7.41 27.35,7.57 29.22,9.43 32.06,9.43 32.72,10.09 32.72,11.75 32.71,11.76
M1_PWM: length 12.6
  Top Layer w0.254: U2.29 33.48,27.69 v1(33.59,27.58) ; U1.23 v1(30.44,19.73)
  Bottom Layer w0.254: v1(30.44,19.73) 30.51,19.8 30.51,24.51 v1(33.59,27.58)
M2_ENA: length 61.1
  Top Layer w0.254: v1(26.25,34.23) 26.35,34.12 30.78,34.12
  Bottom Layer w0.254: v1(26.25,34.23) 25.78,33.76 25.78,6.36 26.43,5.71 51.17,5.71 U4.5
M2_ENB: length 55.7
  Top Layer w0.254: 30.78,33.62 30.37,33.62 29.88,33.13 29.88,32.26 29.81,32.18 28.49,32.18 27.63,31.32 v1(27.63,30.47)
  Bottom Layer w0.254: 51.13,7.66 49.69,6.22 26.56,6.22 26.18,6.59 26.18,29.02 v1(27.63,30.47)
M2_IN1: length 12
  Top Layer w0.254: U2.27 32.48,28.16 32.57,28.08 32.57,25.6 34.34,23.83 34.34,18.2
M2_IN2: length 12.1
  Top Layer w0.254: U2.28 32.98,26.36 34.99,24.35 U1.16
M2_OUT1: length 12.5
  Top Layer w1.016: 47.13,7.66 47.13,8.24 44.15,11.22 U1.12 36.48,11.22
M2_OUT2: length 14.5
  Top Layer w0.381: U1.7 34.34,11.22
  Top Layer w1.016: U4.1 44.09,7.66 42.61,9.14 34.82,9.14 34.02,9.94 34.02,11.77
M2_PWM: length 12
  Top Layer w0.254: 33.98,29.42 33.9,29.34 33.9,28.24 35.64,26.5 35.64,18.2
NRST: length 56
  Top Layer w0.254: 46.23,45.51 46.23,44.95 ; 46.23,44.95 45.84,45.35 31.72,45.35 31,44.63 31,42.93 32.44,41.47 32.44,40.16 33.98,38.62 33.98,36.32 ; 46.23,44.95 46.23,44.25 v1(46.29,44.2)
  Bottom Layer w0.254: H4.6 54.69,20.25 54.69,35.79 v1(46.29,44.2)
OSC_IN: length 9.5
  Top Layer w0.254: 34.98,36.32 34.98,39.52 35.45,39.99 35.45,40.72 34.77,40.72 34.35,41.14 34.35,43.41 35.33,44.39
OSC_OUT: length 7.3
  Top Layer w0.254: 33.13,42.69 33.13,41.81 33.16,41.78 33.16,40.8 33.84,40.8 34.48,40.16 34.48,36.32
PA2: length 26.9
  Top Layer w0.254: v1(22.77,42.77) 29.22,36.32 31.48,36.32
  Bottom Layer w0.254: H3.3 15.57,49.97 v1(22.77,42.77)
PA3: length 29.7
  Top Layer w0.254: H3.2 13.03,50.86 18.54,45.35 18.54,43.29 18.61,43.22 21.44,43.22 29.03,35.62 30.78,35.62
PA4: length 11.5
  Top Layer w0.254: R5.1 24.06,35.91 R6.1 25.29,35.92 25.36,35.85 26.09,35.85 26.09,35.17 30.73,35.17 30.78,35.12
PA10: length 23.3
  Top Layer w0.254: v1(34.52,28.49) 34.48,28.53 34.48,29.42
  Bottom Layer w0.254: 34,50.59 34,29.01 v1(34.52,28.49)
PA11: length 50.6
  Top Layer w0.254: v1(24.13,9.46) 25.05,9.46 30.17,14.58 35.8,14.58 39.4,18.18 39.4,24.44 35.07,28.76 35.09,28.84 34.98,28.95 U2.32 ; 13.24,6.6 13.24,5.67 13.52,5.4 13.97,5.4 14.24,5.67 USB1.A7 14.27,6.6 14.28,6.59 14.28,4.91 v1(13.99,4.62)
  Bottom Layer w0.254: v1(13.99,4.62) 14.28,4.91 14.28,5.71 18.43,9.86 18.87,9.86 19.17,9.57 20.4,9.57 20.69,9.86 21.92,9.86 22.21,9.57 23.45,9.57 23.74,9.86 v1(24.13,9.46)
PA12: length 50.7
  Top Layer w0.254: v1(15.03,4.65) 14.69,4.99 14.69,6.58 14.71,6.6 USB1.B6 14.74,7.53 14.74,7.53 13.74,7.53 13.74,7.53 USB1.A6 ; v1(24.2,8.53) 24.48,8.81 24.98,8.81 30.24,14.07 35.93,14.07 40.01,18.16 40.01,24.41 35.48,28.94 U2.33
  Bottom Layer w0.254: v1(15.03,4.65) 14.69,4.99 14.69,5.54 18.01,8.86 20.05,8.86 21.25,7.66 22.92,7.66 23.79,8.53 v1(24.2,8.53)
PA13: length 22.2
  Top Layer w0.254: H4.5 46.16,18.84 35.98,29.02 U2.34
PA14: length 19.1
  Top Layer w0.254: 37.68,30.12 48.42,30.12 53.56,24.99 H4.1
PA15: length 31.1
  Top Layer w0.254: H4.10 54.74,15.12 54.74,24.8 48.92,30.62 37.68,30.62
PB3: length 30.9
  Top Layer w0.254: H4.8 57.28,17.49 57.28,24.34 50.5,31.12 37.68,31.12
USB_5V: length 10.7
  Top Layer w0.305: USB1.B9 11.55,6.79
  Top Layer w0.381: D2.2 14.93,9.57 16.29,8.21 ; USB1.A9 16.29,6.85
  Top Layer w0.559: 16.32,6.89 16.32,8.18 16.29,8.21 ; 11.55,6.79 11.55,9.12
  Top Layer w0.635: 11.55,9.12 D2.2
VCAP1: length 1.8
  Top Layer w0.254: 29.15,31.5 29.88,31.5 30.26,31.12 30.78,31.12
VM: length 35.7
  Top Layer w0.75: 27.79,18.3 27.79,17.16 29.31,15.65 35.24,15.65 36.53,16.94 36.53,18.81 36.78,19.06 36.78,20.33
  Top Layer w1.016: 29.6,18.2 28.27,18.2 27.83,18.64 ; 27.83,18.64 C1.1 ; 27.83,18.64 27.79,18.3 ; 27.83,18.64 27.83,24.89 21.76,30.96 20.73,30.96 18.67,33.02
$1N8094: length 3.2
  Top Layer w0.254: C7.2 46.62,54.47 46.62,53.63 46.23,53.24 SW1.2
$1N38986: length 2
  Top Layer w0.254: 20.58,9.16 20.61,9.19 22.55,9.19
$1N39065: length 2.2
  Top Layer w0.254: R3.2 28.28,48.61 28.24,48.58 28.24,47.16
$1N77283: length 2.1
  Top Layer w0.254: R1.2 10.88,28.55 10.9,28.57 10.9,29.95

## Copper pours and planes (outline as drawn; the poured copper is in the pictures)
+5V on Top Layer: 17.6,29.34 19.52,29.34 19.56,29.38 19.58,29.36 19.75,29.36 19.75,23.76 19.95,23.56 20.5,22.18 23.42,21.69 21.8,11.56 9.82,11.46 9.73,11.55 9.73,22.22 9.84,22.33 17.51,22.33 17.56,22.38 17.56,29.32 17.58,29.34
GND on Top Layer: -1.46,58.34 72.03,58.34 72.03,-2.56 -1.46,-2.56
GND on Bottom Layer: -6.68,63.22 77.18,63.22 77.18,-7.2 -6.68,-7.2
VIN on Top Layer: 13.07,39.25 17.36,39.25 17.43,39.32 17.43,31.51 16.51,30.59 16.51,29.48 17.09,29.48 17.12,29.45 17.12,23.12 16.97,22.97 12.19,22.97 11.93,22.71 11.93,33.24 13.07,34.38
BAT on Top Layer: 0.8,33.46 8.87,33.46 8.87,16.7 0.8,16.7
USB_5V on Top Layer: 9.94,10.93 16.69,10.78 16.75,5.8 11.19,5.77 11.18,6.61 11.2,8.01 10.05,8.47 9.75,8.64
$1N67980 on Top Layer: 1.15,39.12 12.22,39.12 12.22,33.72 1.15,33.72

Small or netless copper shapes (teardrops, artwork), in the pictures only: 130 on Top Layer, 30 on Bottom Layer

## Text on the board
Bottom Silkscreen Layer: 4/16/2023 V1.0 | Designed by haozhou.wong
Top Silkscreen Layer: PA10 | 5V | VIN | OFF | ON | UART | SERVO | 1 | MOTOR | 2 | MPU6050 | DEBUG | RESET
